# Altium project Cont_Brain.PrjPcb
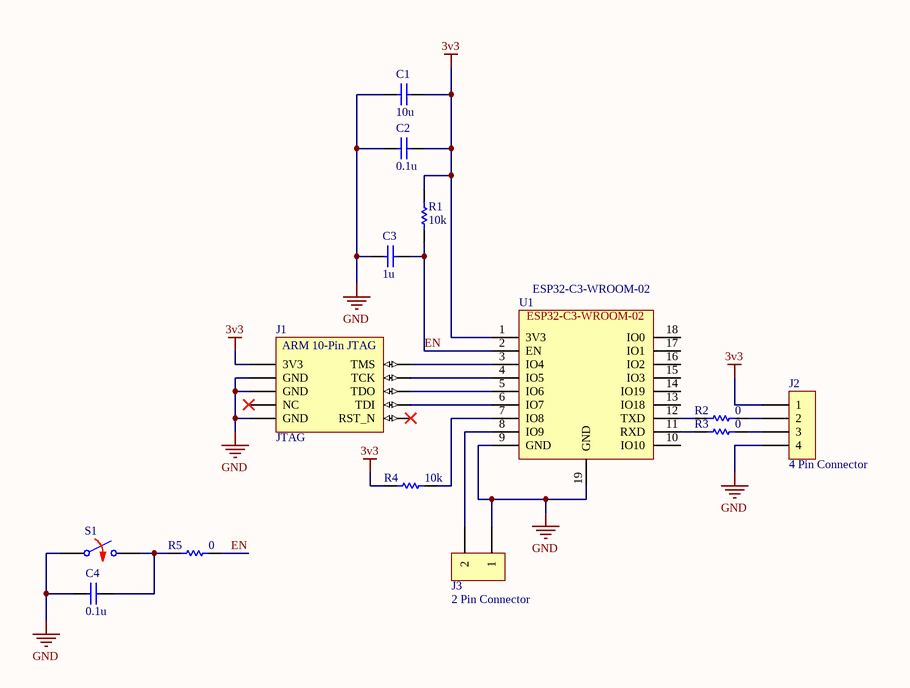
[diagram p0: Cont_Brain.SchDoc]
1 sheet, 14 parts. Net scope: global (net labels, ports and power ports of the same name join across sheets).

## Sheet Cont_Brain.SchDoc
size A4; SheetNumber: 1; SheetTotal: 1

### Parts
C1  value 10u  (hidden comment: Capacitor)
C2  value 0.1u  (hidden comment: Capacitor)
C3  value 1u  (hidden comment: Capacitor)
C4  value 0.1u  (hidden comment: Capacitor)
J1  JTAG
J2  4 Pin Connector  [HW_M20_99904XX]
J3  2 Pin Connector
R1  value 10k  (hidden comment: Resistor)
R2  value 0  (hidden comment: Resistor)
R3  value 0  (hidden comment: Resistor)
R4  value 10k  (hidden comment: Resistor)
R5  value 0  (hidden comment: Resistor)
S1  Switch Normally Opened  [SW_SWT0310-043016GSA_REVA]  (value not drawn)
U1  ESP32-C3-WROOM-02

### Nets
3v3: C1.2 C2.2 J1.1(3V3) J2.1 R1.1 R4.2 U1.1(3V3)
GND: C1.1 C2.1 C3.1 C4.1 J1.3(GND) J1.5(GND) J1.9(GND) J2.4 J3.1 S1.1 U1.9(GND) U1.19(GND)
EN: C3.2 R1.2 R5.1 U1.2(EN)
NetC4_2: C4.2 R5.2 S1.2
NetJ1_2: J1.2(TMS) U1.3(IO4)
NetJ1_4: J1.4(TCK) U1.4(IO5)
NetJ1_6: J1.6(TDO) U1.5(IO6)
NetJ1_8: J1.8(TDI) U1.6(IO7)
NetJ2_2: J2.2 R2.1
NetJ2_3: J2.3 R3.1
NetJ3_2: J3.2 U1.8(IO9)
NetR2_2: R2.2 U1.12(TXD)
NetR3_2: R3.2 U1.11(RXD)
NetR4_1: R4.1 U1.7(IO8)

Not connected (* = marked no-connect by the designer): J1 7(NC)* 10(RST_N)*; U1 10(IO10) 13(IO18) 14(IO19) 15(IO3) 16(IO2) 17(IO1) 18(IO0)

### Notes on the sheet
- (in symbol JTAG) ARM 10-Pin JTAG

### Library data of the parts
C1-C4 = Capacitor: SimulationGenericComponent: True
J1 = JTAG: Genaric JTAG Arm 10-Pin (Cortex Debug) Header
R1 R4 = Resistor: TC1: 0; SimulationGenericComponent: True; TC2: 0
R2 R3 R5 = Resistor: SimulationGenericComponent: True; TC1: 0; TC2: 0
S1 = SW NO: closed: 0; Rclosed: 1m; Ropen: 1Meg; SimulationGenericComponent: True
U1 = ESP32-C3-WROOM-02: Symbol for ESP32-C3-WROOM-02 module, https://www.espressif.com/sites/default/files/documentation/esp32-c3-wroom-02_datasheet_en.pdf